# EAGLE design i2c2lcd (EAGLE 6.5.0)
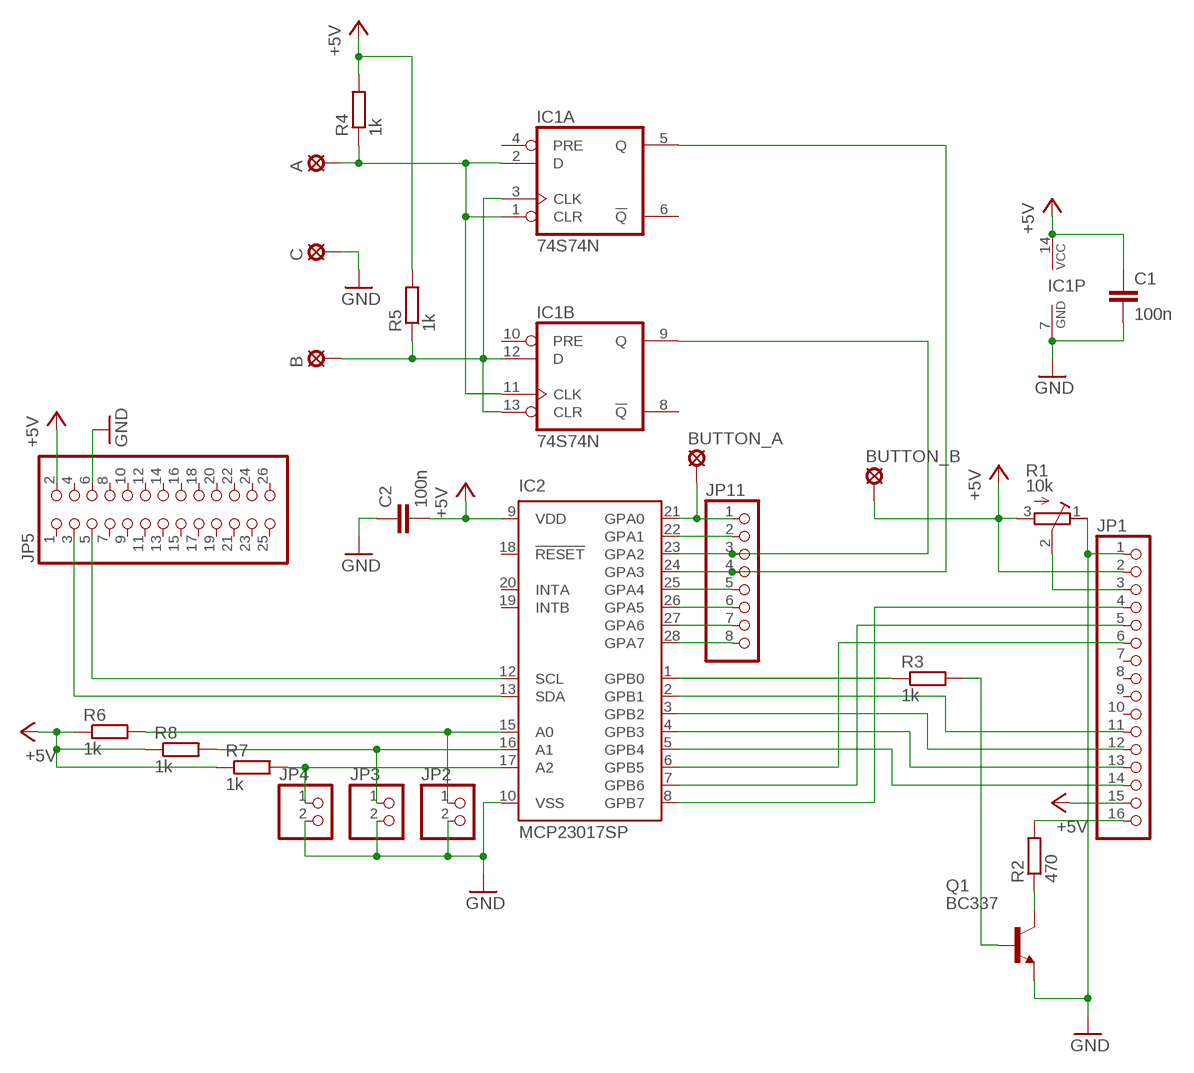
[diagram p0: schematic, sheet 1]

## Parts
A  LSP13  [LSP13]
B  LSP13  [LSP13]
BUTTON_A  LSP13  [LSP13]
BUTTON_B  LSP13  [LSP13]
C  LSP13  [LSP13]
C1  100n  C-EUC1206K  [C1206K]
C2  100n  C-EUC1206K  [C1206K]
IC1  74S74N  [DIL14]
IC2  MCP23017SP  [DIL28-3]
JP1  PINHD-1X16  [1X16]
JP2  PINHD-1X2  [1X02]
JP3  PINHD-1X2  [1X02]
JP4  PINHD-1X2  [1X02]
JP5  PINHD-2X13  [2X13]
JP11  PINHD-1X8  [1X08]
Q1  BC337  [TO92]
R1  10k  R-TRIMM3006P  [RTRIM3006P]
R2  470  R-EU_0207/10  [0207/10]
R3  1k  R-EU_0207/12  [0207/12]
R4  1k  R-EU_0207/10  [0207/10]
R5  1k  R-EU_0207/10  [0207/10]
R6  1k  R-EU_0207/10  [0207/10]
R7  1k  R-EU_0207/10  [0207/10]
R8  1k  R-EU_0207/10  [0207/10]

## Nets
+5V: BUTTON_B.MP C1.1 C2.2 IC1.14(P:VCC) IC2.9(VDD) JP1.2 JP1.15 JP5.2 R1.3(A) R4.2 R5.2 R6.1 R7.1 R8.1
GND: C1.2 C2.1 C.MP IC1.7(P:GND) IC2.10(VSS) JP1.1 JP2.2 JP3.2 JP4.2 JP5.6 Q1.1(E) R1.1(E)
N$1: JP1.3 R1.2(S)
N$2: IC2.8(GPB7) JP1.4
N$3: IC2.7(GPB6) JP1.5
N$4: IC2.22(GPA1) JP11.2
N$5: IC2.5(GPB4) JP1.14
N$6: IC2.4(GPB3) JP1.13
N$7: IC2.3(GPB2) JP1.12
N$8: IC2.2(GPB1) JP1.11
N$9: JP1.16 R2.2
N$10: Q1.3(C) R2.1
N$11: Q1.2(B) R3.2
N$12: IC2.1(GPB0) R3.1
N$13: IC2.15(A0) JP2.1 R6.2
N$14: B.MP IC1.3(A:CLK) IC1.12(B:D) IC1.13(B:CLR) R5.1
N$15: IC2.16(A1) JP3.1 R8.2
N$17: IC2.17(A2) JP4.1 R7.2
N$18: IC1.5(A:Q) IC2.24(GPA3) JP11.4
N$19: IC1.9(B:Q) IC2.23(GPA2) JP11.3
N$20: IC2.6(GPB5) JP1.6
N$21: BUTTON_A.MP IC2.21(GPA0) JP11.1
N$22: IC2.13(SDA) JP5.3
N$23: IC2.12(SCL) JP5.5
N$24: IC2.25(GPA4) JP11.5
N$25: IC2.26(GPA5) JP11.6
N$26: IC2.27(GPA6) JP11.7
N$27: IC2.28(GPA7) JP11.8
N$28: A.MP IC1.1(A:CLR) IC1.2(A:D) IC1.11(B:CLK) R4.1
Unconnected: IC1.4(A:PRE) IC1.6(A:!Q) IC1.8(B:!Q) IC1.10(B:PRE) IC2.18(!RESET) IC2.19(INTB) IC2.20(INTA) JP1.7 JP1.8 JP1.9 JP1.10 JP5.1 JP5.4 JP5.7 JP5.8 JP5.9 JP5.10 JP5.11 JP5.12 JP5.13 JP5.14 JP5.15 JP5.16 JP5.17 JP5.18 JP5.19 JP5.20 JP5.21 JP5.22 JP5.23 JP5.24 JP5.25 JP5.26

## Library data of the parts
A B BUTTON_A BUTTON_B C = solpad:LSP13: SOLDER PAD drill 1.3 mm, distributor Buerklin, 12H562
C1 C2 = rcl:C-EU: CAPACITOR, European symbol
IC1 = 74xx-eu:74*74: Dual D type positive edge triggered FLIP FLOP, preset and clear
IC2 = microchip:MCP23017: http://ww1.microchip.com/downloads/en/DeviceDoc/21952a.pdf Source: http://ww1.microchip.com/downloads/en/DeviceDoc/21952a.pdf; MF: MICROCHIP; MPN: MCP23017-E/SP; OC_FARNELL: 1332088; OC_NEWARK: 31K2959
JP1 = pinhead:PINHD-1X16: PIN HEADER
JP2-JP4 = pinhead:PINHD-1X2: PIN HEADER
JP5 = pinhead:PINHD-2X13: PIN HEADER
JP11 = pinhead:PINHD-1X8: PIN HEADER
Q1 = transistor-npn:BC337*: NPN Transistor
R1 = rcl:R-TRIMM: Trimm resistor
R2-R8 = rcl:R-EU_: RESISTOR, European symbol

## Board
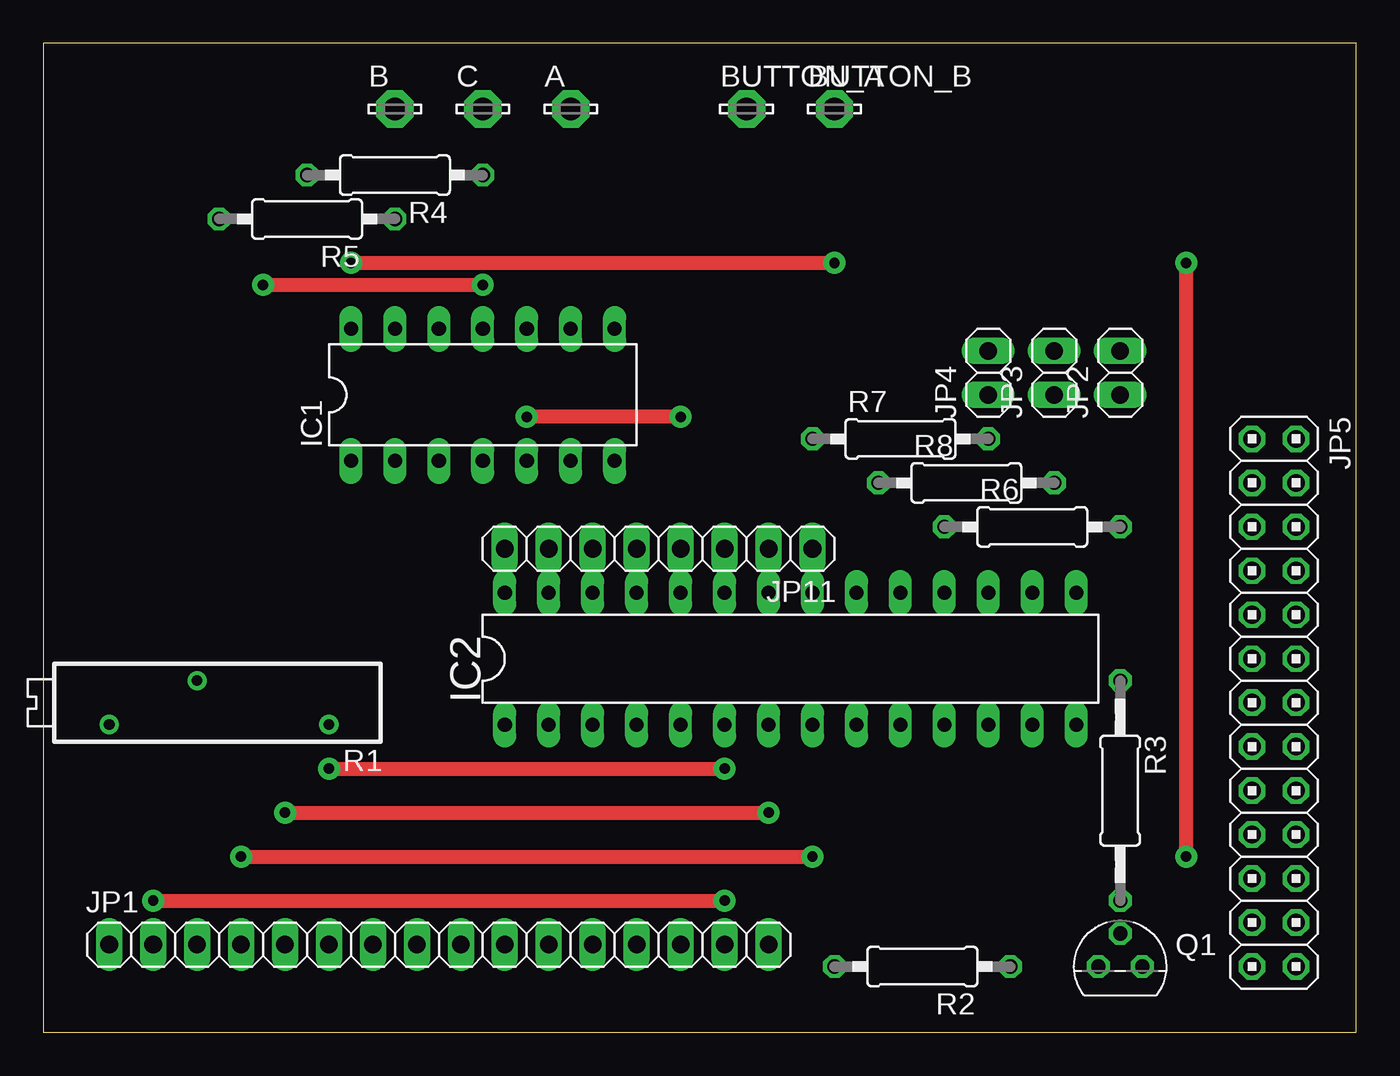
[diagram p1: board, top side]
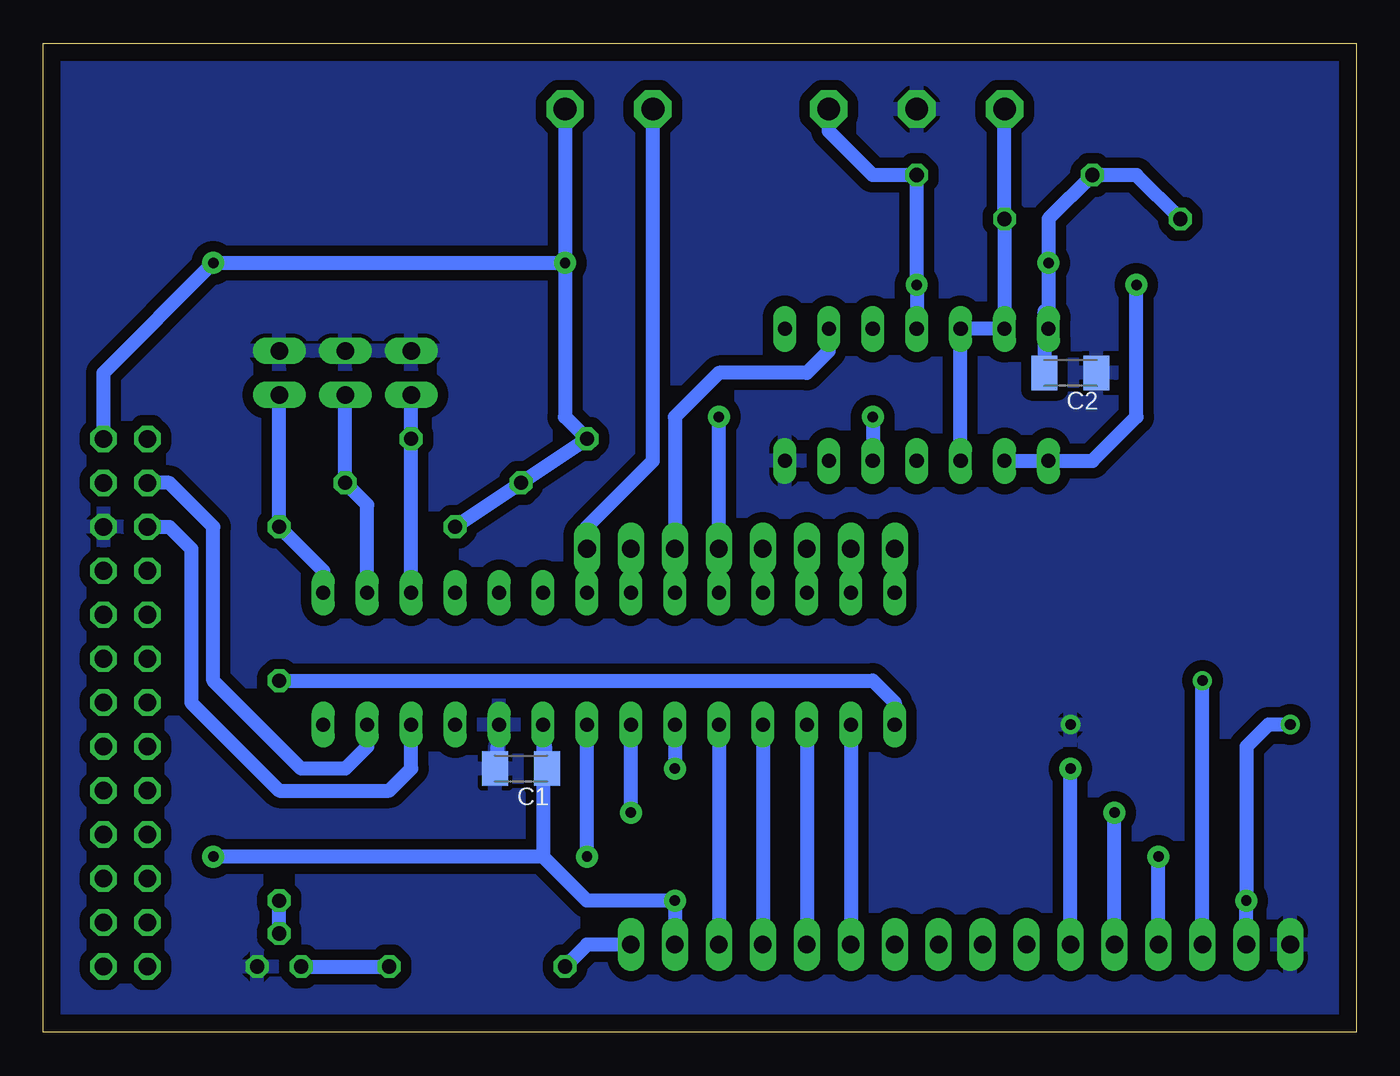
[diagram p2: board, bottom side, seen from below]

Size 75.87 x 57.14 mm. Coordinates in mm from the lower left corner, seen from the top.
Outline: 0,0 75.87,0 75.87,57.14 0,57.14 0,0
Copper layers (1*16): Top 0.035mm / dielectric 1.5mm / Bottom 0.035mm
Design rules "default": minimum track width 10mil, minimum drill 24mil, track to track 8mil, track to pad 8mil, pad to pad 8mil, via to via 8mil, smd to smd 8mil, copper to edge 40mil, drill to drill 8mil, minimum pad ring 10mil, minimum via ring 8mil, stop-mask expansion 4mil, vias tented up to drill 0mil, thermal gap 10mil

### Footprints (pad centres in the part's own frame; a part is rotated, then mirrored left to right if it is on the bottom)
LSP13 = drill 1.321 pad 2.159 octagon: MP 0,0
C1206K = smd 1.5 x 2: 1 -1.5,0; 2 1.5,0
DIL14 = drill 0.813 long: 1 -7.62,-3.81; 2 -5.08,-3.81; 3 -2.54,-3.81; 4 0,-3.81; 5 2.54,-3.81; 6 5.08,-3.81; 7 7.62,-3.81; 8 7.62,3.81; 9 5.08,3.81; 10 2.54,3.81; 11 0,3.81; 12 -2.54,3.81; 13 -5.08,3.81; 14 -7.62,3.81
DIL28-3 = drill 0.813 long: 1 -16.51,-3.81; 2 -13.97,-3.81; 3 -11.43,-3.81; 4 -8.89,-3.81; 5 -6.35,-3.81; 6 -3.81,-3.81; 7 -1.27,-3.81; 8 1.27,-3.81; 9 3.81,-3.81; 10 6.35,-3.81; 11 8.89,-3.81; 12 11.43,-3.81; 13 13.97,-3.81; 14 16.51,-3.81; 15 16.51,3.81; 16 13.97,3.81; 17 11.43,3.81; 18 8.89,3.81; 19 6.35,3.81; 20 3.81,3.81; 21 1.27,3.81; 22 -1.27,3.81; 23 -3.81,3.81; 24 -6.35,3.81; 25 -8.89,3.81; 26 -11.43,3.81; 27 -13.97,3.81; 28 -16.51,3.81
1X16 = drill 1.016 long: 1 -19.05,0; 2 -16.51,0; 3 -13.97,0; 4 -11.43,0; 5 -8.89,0; 6 -6.35,0; 7 -3.81,0; 8 -1.27,0; 9 1.27,0; 10 3.81,0; 11 6.35,0; 12 8.89,0; 13 11.43,0; 14 13.97,0; 15 16.51,0; 16 19.05,0
1X02 = drill 1.016 long: 1 -1.27,0; 2 1.27,0
2X13 = drill 1.016 octagon: 1 -15.24,-1.27; 2 -15.24,1.27; 3 -12.7,-1.27; 4 -12.7,1.27; 5 -10.16,-1.27; 6 -10.16,1.27; 7 -7.62,-1.27; 8 -7.62,1.27; 9 -5.08,-1.27; 10 -5.08,1.27; 11 -2.54,-1.27; 12 -2.54,1.27; 13 0,-1.27; 14 0,1.27; 15 2.54,-1.27; 16 2.54,1.27; 17 5.08,-1.27; 18 5.08,1.27; 19 7.62,-1.27; 20 7.62,1.27; 21 10.16,-1.27; 22 10.16,1.27; 23 12.7,-1.27; 24 12.7,1.27; 25 15.24,-1.27; 26 15.24,1.27
1X08 = drill 1.016 long: 1 -8.89,0; 2 -6.35,0; 3 -3.81,0; 4 -1.27,0; 5 1.27,0; 6 3.81,0; 7 6.35,0; 8 8.89,0
TO92 = drill 0.813 octagon: 1 1.27,0; 2 0,1.905; 3 -1.27,0
RTRIM3006P = drill 0.61: 1 -7.62,1.27; 2 0,-1.27; 3 5.08,1.27
0207/10 = drill 0.813 octagon: 1 -5.08,0; 2 5.08,0
0207/12 = drill 0.813 octagon: 1 -6.35,0; 2 6.35,0

### Placement (x,y rotation side)
A  30.48,53.34 0 top
B  20.32,53.34 0 top
BUTTON_A  40.64,53.34 0 top
BUTTON_B  45.72,53.34 0 top
C  25.4,53.34 0 top
C1  48.26,15.24 180 bottom
C2  16.51,38.1 180 bottom
IC1  25.4,36.83 0 top
IC2  43.18,21.59 0 top
JP1  22.86,5.08 0 top
JP2  62.23,38.1 90 top
JP3  58.42,38.1 90 top
JP4  54.61,38.1 90 top
JP5  71.12,19.05 270 top
JP11  35.56,27.94 180 top
Q1  62.23,3.81 0 top
R1  8.89,19.05 180 top
R2  50.8,3.81 180 top
R3  62.23,13.97 270 top
R4  20.32,49.53 180 top
R5  15.24,46.99 180 top
R6  57.15,29.21 0 top
R7  49.53,34.29 0 top
R8  53.34,31.75 0 top

### Tracks (layer width: path | path; a pad name or v marks a point on that pad's centre or on a via)
+5V  (via drill 0.6 pad 1.27)
  Top 0.813: v17.78,44.45 v45.72,44.45 | v6.35,7.62 v39.37,7.62 | v66.04,10.16 v66.04,44.45
  Bottom 0.813: R1.3 5.08,17.78 6.35,16.51 v6.35,7.62 JP1.2 | 46.99,17.55 C1.1 | C2.2 18.01,41.68 IC1.14 v17.78,44.45 17.78,46.99 R4.2 12.7,49.53 R5.2 | R6.1 R8.1 R7.1 45.72,35.56 v45.72,44.45 | JP5.2 72.39,38.1 v66.04,44.45 v45.72,44.45 | BUTTON_B.MP v45.72,44.45 | 46.99,17.55 46.99,10.16 | JP1.15 v39.37,7.62 44.45,7.62 46.99,10.16 | IC2.9 46.99,17.55 | 46.99,10.16 v66.04,10.16
GND
  Bottom 0.813: IC2.10 49.53,17.55 C1.2
  pour Bottom (isolate 0.61): 0,57.15 76.2,57.15 76.2,0 0,0
N$1
  Bottom 0.813: JP1.3 R1.2
N$2  (via drill 0.6 pad 1.27)
  Top 0.813: v11.43,10.16 v44.45,10.16
  Bottom 0.813: JP1.4 v11.43,10.16 | v44.45,10.16 IC2.8
N$3  (via drill 0.6 pad 1.27)
  Top 0.813: v13.97,12.7 v41.91,12.7
  Bottom 0.813: JP1.5 v13.97,12.7 | v41.91,12.7 IC2.7
N$4
  Bottom 0.813: IC2.22 JP11.2
N$5
  Bottom 0.813: IC2.5 JP1.14
N$6
  Bottom 0.813: IC2.4 JP1.13
N$7
  Bottom 0.813: IC2.3 JP1.12
N$8
  Bottom 0.813: IC2.2 JP1.11
N$9
  Bottom 0.813: JP1.16 44.45,5.08 R2.2
N$10
  Bottom 0.813: Q1.3 R2.1
N$11
  Bottom 0.813: Q1.2 R3.2
N$12
  Bottom 0.813: R3.1 27.94,20.32 26.67,19.05 IC2.1
N$13
  Bottom 0.813: IC2.15 59.69,26.67 R6.2 JP2.1
N$14
  Bottom 0.813: IC1.3 IC1.12 IC1.13 R5.1 B.MP
N$15
  Bottom 0.813: IC2.16 57.15,30.48 R8.2 JP3.1
N$17
  Bottom 0.813: IC2.17 R7.2 JP4.1
N$18  (via drill 0.6 pad 1.27)
  Top 0.813: v36.83,35.56 v27.94,35.56
  Bottom 0.813: v36.83,35.56 JP11.4 IC2.24 | v27.94,35.56 IC1.5
N$19
  Bottom 0.813: IC1.9 30.48,39.37 31.75,38.1 36.83,38.1 39.37,35.56 JP11.3 IC2.23
N$20  (via drill 0.6 pad 1.27)
  Top 0.813: v16.51,15.24 v39.37,15.24
  Bottom 0.813: JP1.6 v16.51,15.24 | IC2.6 v39.37,15.24
N$21
  Bottom 0.813: IC2.21 JP11.1 44.45,29.21 40.64,33.02 BUTTON_A.MP
N$22
  Bottom 0.813: JP5.3 68.58,31.75 66.04,29.21 66.04,20.32 60.96,15.24 58.42,15.24 57.15,16.51 IC2.13
N$23
  Bottom 0.813: JP5.5 68.58,29.21 67.31,27.94 67.31,19.05 62.23,13.97 55.88,13.97 54.61,15.24 IC2.12
N$24
  Bottom 0.813: IC2.25 JP11.5
N$25
  Bottom 0.813: IC2.26 JP11.6
N$26
  Bottom 0.813: IC2.27 JP11.7
N$27
  Bottom 0.813: IC2.28 JP11.8
N$28  (via drill 0.6 pad 1.27)
  Top 0.813: v12.7,43.18 v25.4,43.18
  Bottom 0.813: A.MP 30.48,52.07 27.94,49.53 R4.1 v25.4,43.18 IC1.11 | IC1.2 IC1.1 15.24,33.02 12.7,35.56 v12.7,43.18